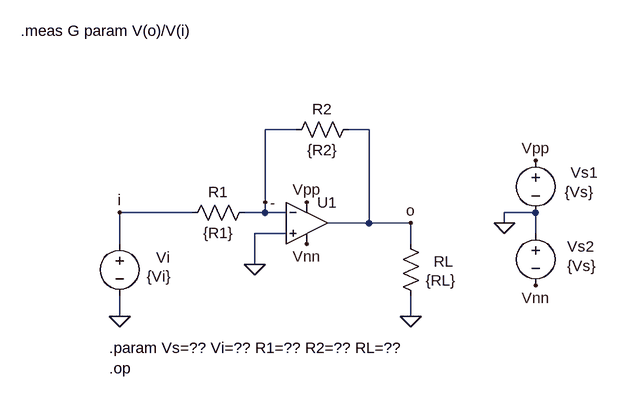
[diagram p0: schematic Amp01opFig.asc]
Amp01opFig.asc, the LTspice schematic file:
Version 4
SHEET 1 968 680
WIRE 144 80 96 80
WIRE 256 80 224 80
WIRE 96 192 96 80
WIRE -16 208 -128 208
WIRE 96 208 96 192
WIRE 96 208 64 208
WIRE 128 208 96 208
WIRE 512 208 464 208
WIRE 256 224 256 80
WIRE 256 224 192 224
WIRE 320 224 256 224
WIRE 464 224 464 208
WIRE 128 240 80 240
WIRE 512 240 512 208
WIRE -128 256 -128 208
WIRE 320 256 320 224
WIRE 80 288 80 240
WIRE -128 368 -128 336
WIRE 320 368 320 336
FLAG 512 128 Vpp
FLAG 464 224 0
FLAG 512 320 Vnn
FLAG 320 368 0
FLAG -128 368 0
FLAG 160 192 Vpp
FLAG 160 256 Vnn
FLAG 80 288 0
FLAG 320 224 o
FLAG -128 208 i
FLAG 96 192 -
SYMBOL voltage 512 112 R0
WINDOW 123 0 0 Left 0
WINDOW 39 0 0 Left 0
WINDOW 0 54 34 Left 2
WINDOW 3 45 64 Left 2
SYMATTR InstName Vs1
SYMATTR Value {Vs}
SYMBOL voltage 512 224 R0
WINDOW 123 0 0 Left 0
WINDOW 39 0 0 Left 0
WINDOW 0 49 36 Left 2
WINDOW 3 49 66 Left 2
SYMATTR InstName Vs2
SYMATTR Value {Vs}
SYMBOL res 304 240 R0
WINDOW 0 51 43 Left 2
WINDOW 3 39 72 Left 2
SYMATTR InstName RL
SYMATTR Value {RL}
SYMBOL voltage -128 240 R0
WINDOW 3 42 66 Left 2
WINDOW 123 0 0 Left 0
WINDOW 39 0 0 Left 0
WINDOW 0 56 37 Left 2
SYMATTR Value {Vi}
SYMATTR InstName Vi
SYMBOL Opamps\\UniversalOpamp2 160 224 R0
SYMATTR InstName U1
SYMBOL res 80 192 R90
WINDOW 0 0 56 VBottom 2
WINDOW 3 32 56 VTop 2
SYMATTR InstName R1
SYMATTR Value {R1}
SYMBOL res 240 64 R90
WINDOW 0 0 56 VBottom 2
WINDOW 3 32 56 VTop 2
SYMATTR InstName R2
SYMATTR Value {R2}
TEXT -144 416 Left 2 !.param Vs=?? Vi=?? R1=?? R2=?? RL=??
TEXT -144 448 Left 2 !.op
TEXT -280 -72 Left 2 !.meas G param V(o)/V(i)

The netlist it stands for:
* Amp01opFig.asc
Vs1 Vpp 0 {Vs}
Vs2 0 Vnn {Vs}
RL o 0 {RL}
Vi i 0 {Vi}
XU1 0 - Vpp Vnn o level.2 Avol=1Meg GBW=10Meg Slew=10Meg ilimit=25m rail=0 Vos=0 phimargin=45 en=0 enk=0 in=0 ink=0 Rin=500Meg  ; pins IN+ IN- V+ V- OUT
R1 - i {R1}
R2 o - {R2}
.param Vs=?? Vi=?? R1=?? R2=?? RL=??
.op
.meas G param V(o)/V(i)
.lib UniversalOpamps2.sub
.backanno
.end